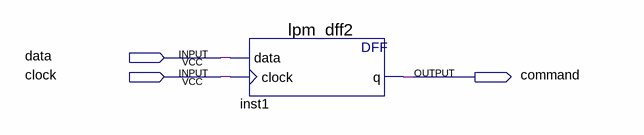
[diagram p0: schematic sheet]
// Quartus schematic CommandRegister.bdf as structural Verilog: 1 symbols, 3 pins
module CommandRegister (
  input  data,
  input  clock,
  output command
);

  lpm_dff2 inst1 (.data(data), .clock(clock), .q(command));
endmodule
